# Altium project AIR_MONITOR_OLED.PrjPcb
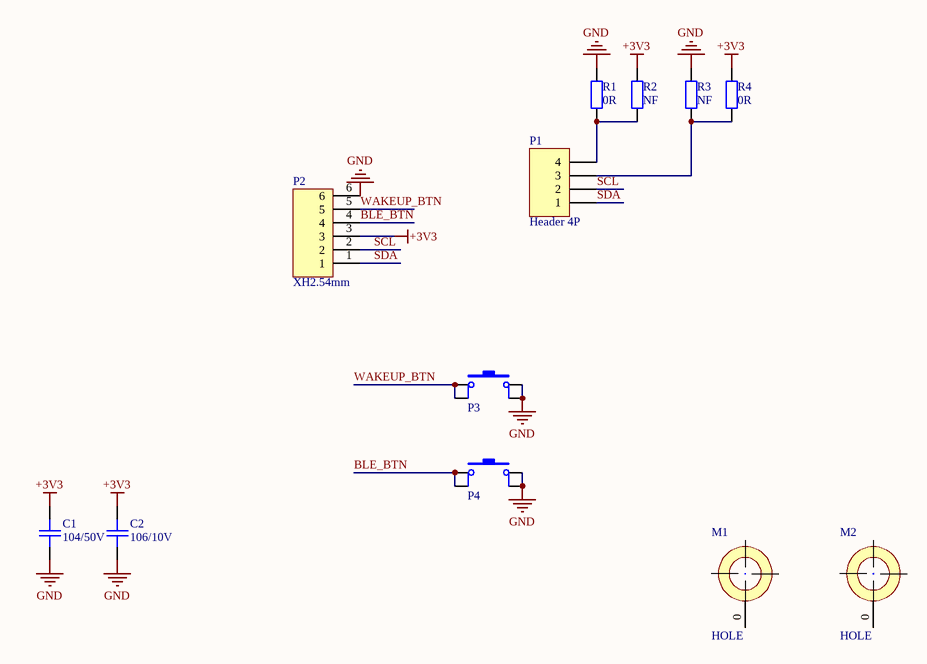
[diagram p0: OLED.SchDoc]
CURRENTREVISION: A00; globalprojectlink: CC2650_MONITOR; GLOBALPROJECTTEAM: THAI
1 sheet, 12 parts. Net scope: global (net labels, ports and power ports of the same name join across sheets).
Board file: PCB_OLED.PcbDoc

## Sheet OLED.SchDoc
size A4

### Parts
C1  104/50V  [CAPC-0603 (1608) - HD]
C2  106/10V  [CAPC-0603 (1608) - HD]
M1  HOLE  [HOLE_3MM_6MM]  (no BOM)
M2  HOLE  [HOLE_3MM_6MM]  (no BOM)
P1  Header 4P  [HDR1X4]
P2  XH2.54mm  [XH2.54-6p]
P3  (no value)  [B3F BUTTON]
P4  (no value)  [B3F BUTTON]
R1  0R  [RESC-0603 (1608) - HD]
R2  NF  [RESC-0603 (1608) - HD]
R3  NF  [RESC-0603 (1608) - HD]
R4  0R  [RESC-0603 (1608) - HD]

### Nets
+3V3: C1.2 C2.2 P2.3 R2.2 R4.2
GND: C1.1 C2.1 P2.6 P3.2 P3.4 P4.2 P4.4 R1.2 R3.2
BLE_BTN: P2.4 P4.1 P4.2
SCL: P1.2 P2.2
SDA: P1.1 P2.1
WAKEUP_BTN: P2.5 P3.1 P3.2
NetP1_3: P1.3 R3.1 R4.1
NetP1_4: P1.4 R1.1 R2.1

Not connected (* = marked no-connect by the designer): M1 0; M2 0

### Notes on the sheet
- Title
- Size:
- Date:
- A4
- Number:
- Time:
- Revision:
- Sheet
- of
- File:

### Library data of the parts
C1 = C0603C104K5RACTU: CAP CER 0.1uF 50V 10% X7R 0603; MFR: KEMET; Solder: SMT; Company ID: VT00574; MPN: C0603C104K5RACTU; Value: 104/50V
C2 = CL10A106KP8NNNC: CAP CER 10uF 10% 10V X5R 0603; MFR: Samsung Electro-Mechanics; Solder: SMT; Conpany ID: VT00807; MPN: CL10A106KP8NNNC; Value: 106/10V; Category: Capacitor
M1 M2 = HOLE_2_4/2_5/3_5/3_6: HOLE 2_4/2_5/3_5/3_6; MPN: None; Solder: Not Fill; CompanyID: VT-; ClassName: MECH_HOLE; Value: HOLE
P1 = Header 4x1: Header, 4 Pin Pitch 2.54mm; MPN: S1012EC-40-ND; Company ID: VT-00125; Solder: WAVE; Value: Header 4P
P2 = XH2.54-6p: XH2.54mmm - 6P 180 degree; MFR: CHINA; MPN: XH2.54-6P; Value: XH2.54mm
P3 P4 = B3F: BUTTON 12X12X7.3MM; Solder: Wave; MPN: B3F; Category: Button; URL: http://linhkienchatluong.vn/nut-nhan-12x12-4p-dip/nut-nhan-4-chan-12x12x73mm-b3f-4055_sp689_ct1833.aspx
R1 R4 = RC0603FR-070RL: RES SMD 0.0OHM JUMPER 1/10W 0603; MFR: Yageo; Solder: SMT; Company ID: VT00423; MPN: RC0603FR-070RL; Value: 0R; Category: Resistor
R2 R3 = RC0603FR-070RL: RES SMD 0.0OHM JUMPER 1/10W 0603; MFR: Yageo; Value: 0R; Solder: SMT; Company ID: VT00423; MPN: RC0603FR-070RL; Category: Resistor